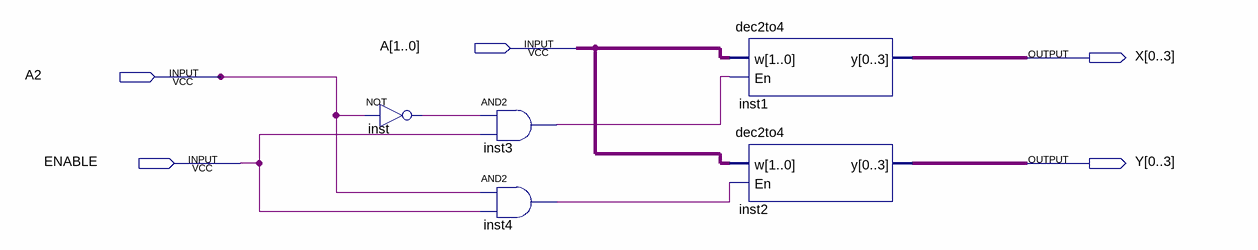
[diagram p0: schematic sheet]
// Quartus schematic lab4_decoder.bdf as structural Verilog: 5 symbols, 5 pins
module lab4_decoder (
  input  [1:0] A,
  input  A2,
  input  ENABLE,
  output [0:3] X,
  output [0:3] Y
);

  wire inst3_out, inst4_out, inst_out;

  not inst (inst_out, A2);
  and inst3 (inst3_out, inst_out, ENABLE);
  and inst4 (inst4_out, A2, ENABLE);
  dec2to4 inst1 (.w(A), .En(inst3_out), .y(X));
  dec2to4 inst2 (.w(A), .En(inst4_out), .y(Y));
endmodule
